# EAGLE board interfacez_r2 (EAGLE 6.4)
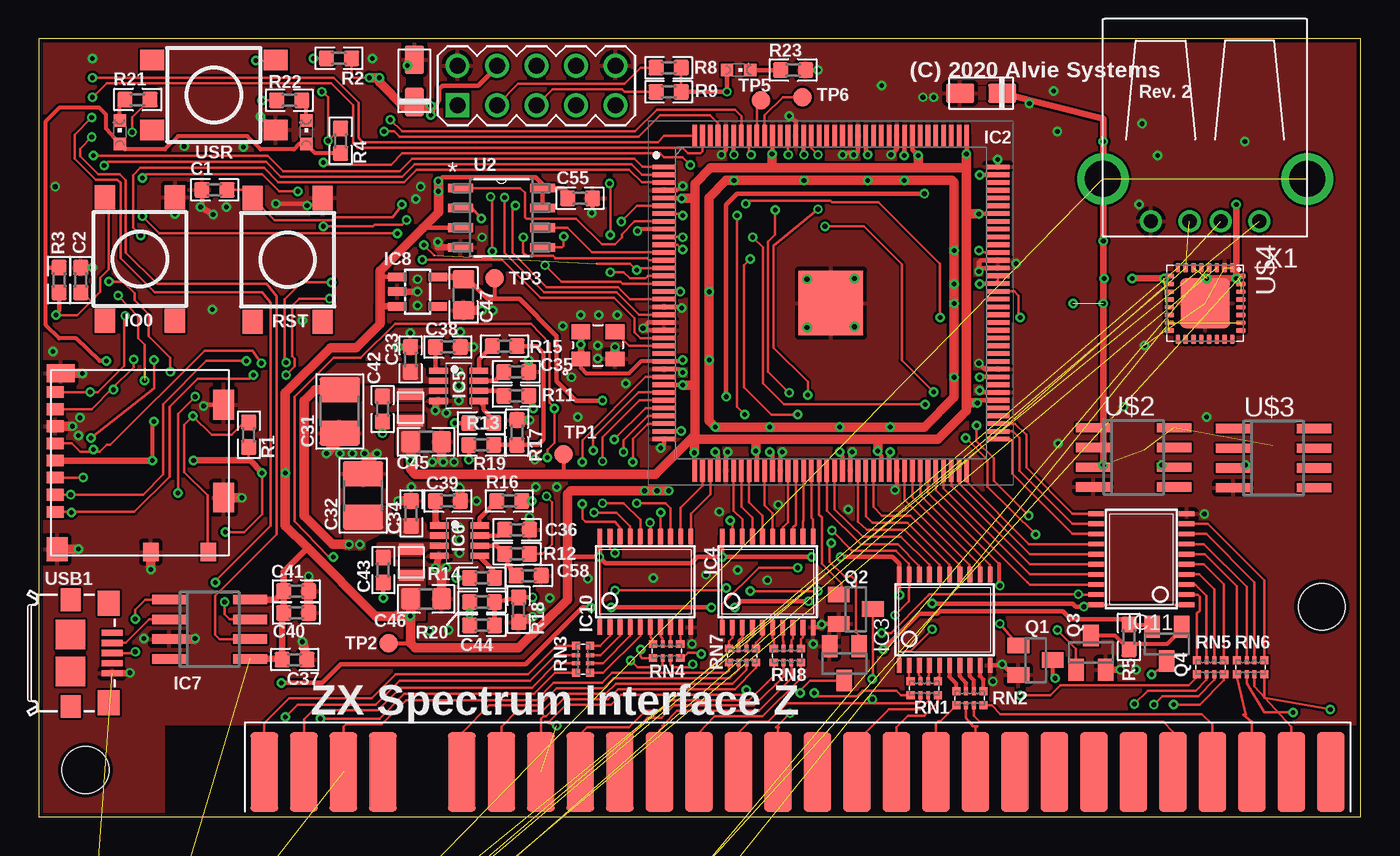
[diagram p3: board, top side]
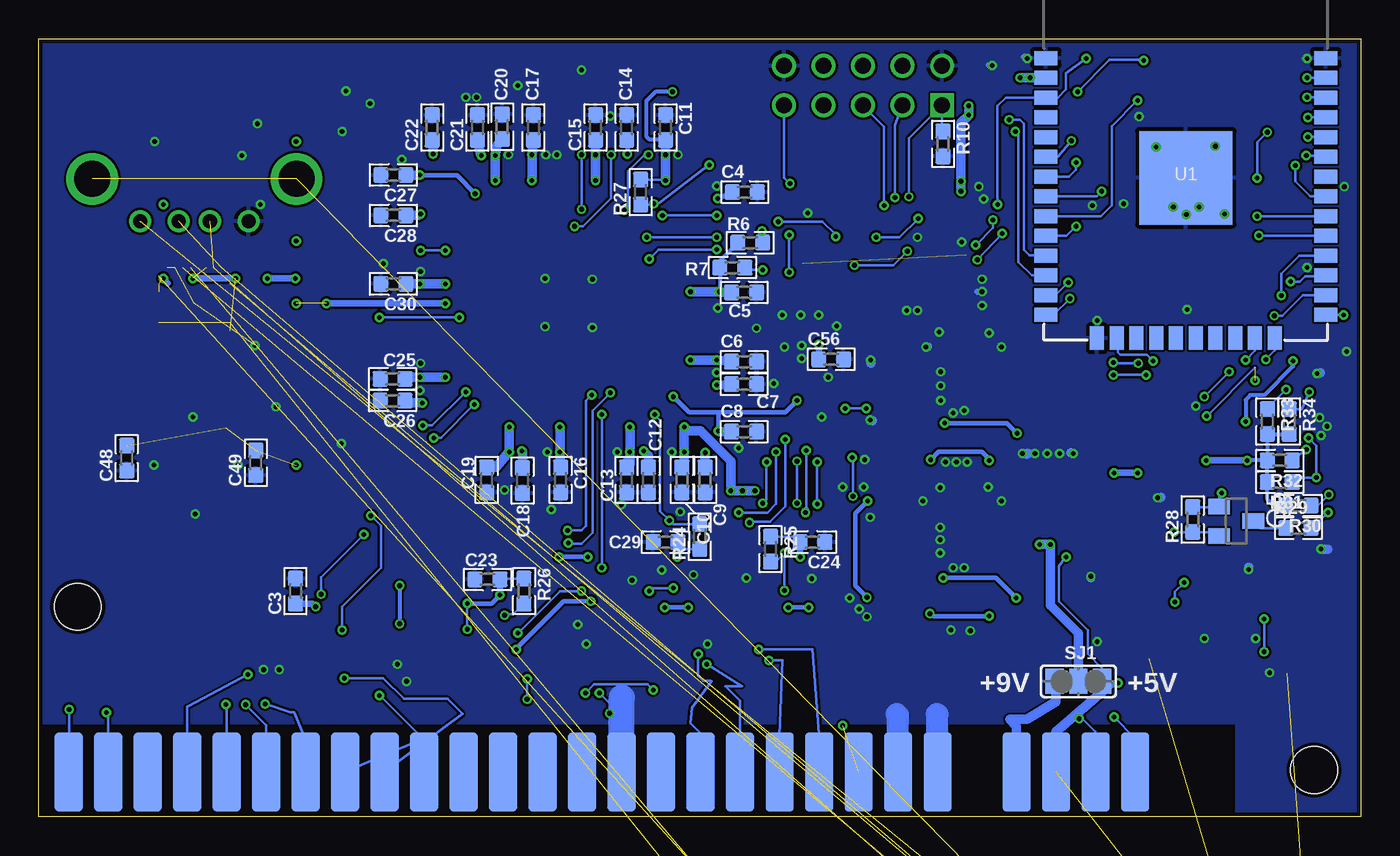
[diagram p4: board, bottom side, seen from below]

Size 85 x 50 mm. Coordinates in mm from the lower left corner, seen from the top.
Outline: 0,50 0,0 85,0 85,50 0,50
Copper layers (1*16): Top 0.035mm / dielectric 1.5mm / Bottom 0.035mm
Design rules "JLCPCB-Single-DualLayer": minimum track width 5mil, minimum drill 0.3mm, track to track 6mil, track to pad 6mil, pad to pad 6mil, via to via 6mil, smd to smd 0mil, copper to edge 10mil, drill to drill 10mil, minimum pad ring 10mil, minimum via ring 6mil, stop-mask expansion 2mil, vias tented up to drill 100mil, thermal gap 10mil
Holes 3 mm at 3,3 82.5,13.5

## Footprints (pad centres in the part's own frame; a part is rotated, then mirrored left to right if it is on the bottom)
0603 = smd 1 x 1: 1 -0.8,0; 2 0.8,0
1210 = smd 1.6 x 2.6: 1 -1.4,0; 2 1.4,0
0805 = smd 1.2 x 1.4: 1 -1,0; 2 1,0
TANT_CASE_A = smd 1.8 x 1.23: MINUS 1.355,0; PLUS -1.355,0
ZX-EDGE-DAUGHTERBOARD = smd 1.778 x 5.08 bottom: A1 6.35,-1.27; A2 3.81,-1.27; A3 1.27,-1.27; A4 -1.27,-1.27; A6 -6.35,-1.27; A7 -8.89,-1.27; A8 -11.43,-1.27; A9 -13.97,-1.27; A10 -16.51,-1.27; A11 -19.05,-1.27; A12 -21.59,-1.27; A13 -24.13,-1.27; A14 -26.67,-1.27; A15 -29.21,-1.27; A16 -31.75,-1.27; A17 -34.29,-1.27; A18 -36.83,-1.27; A19 -39.37,-1.27; A20 -41.91,-1.27; A21 -44.45,-1.27; A22 -46.99,-1.27; A23 -49.53,-1.27; A24 -52.07,-1.27; A25 -54.61,-1.27; A26 -57.15,-1.27; A27 -59.69,-1.27; A28 -62.23,-1.27 | smd 1.778 x 5.08: B1 6.35,-1.27; B2 3.81,-1.27; B3 1.27,-1.27; B4 -1.27,-1.27; B6 -6.35,-1.27; B7 -8.89,-1.27; B8 -11.43,-1.27; B9 -13.97,-1.27; B10 -16.51,-1.27; B11 -19.05,-1.27; B12 -21.59,-1.27; B13 -24.13,-1.27; B14 -26.67,-1.27; B15 -29.21,-1.27; B16 -31.75,-1.27; B17 -34.29,-1.27; B18 -36.83,-1.27; B19 -39.37,-1.27; B20 -41.91,-1.27; B21 -44.45,-1.27; B22 -46.99,-1.27; B23 -49.53,-1.27; B24 -52.07,-1.27; B25 -54.61,-1.27; B26 -57.15,-1.27; B27 -59.69,-1.27; B28 -62.23,-1.27
PIN-2X5 = drill 1.016 square: 1 -5.08,-1.27 | drill 1.016: 2 -5.08,1.27; 3 -2.54,-1.27; 4 -2.54,1.27; 5 0,-1.27; 6 0,1.27; 7 2.54,-1.27; 8 2.54,1.27; 9 5.08,-1.27; 10 5.08,1.27
SOT23-5L = smd 0.55 x 1.2: 1 -0.95,-1.3; 2 0,-1.3; 3 0.95,-1.3; 4 0.95,1.3; 5 -0.95,1.3
QFP50P2200X2200X165-145N = smd 1.475 x 0.3: 1 -10.738,8.75; 2 -10.738,8.25; 3 -10.738,7.75; 4 -10.738,7.25; 5 -10.738,6.75; 6 -10.738,6.25; 7 -10.738,5.75; 8 -10.738,5.25; 9 -10.738,4.75; 10 -10.738,4.25; 11 -10.738,3.75; 12 -10.738,3.25; 13 -10.738,2.75; 14 -10.738,2.25; 15 -10.738,1.75; 16 -10.738,1.25; 17 -10.738,0.75; 18 -10.738,0.25; 19 -10.738,-0.25; 20 -10.738,-0.75; 21 -10.738,-1.25; 22 -10.738,-1.75; 23 -10.738,-2.25; 24 -10.738,-2.75; 25 -10.738,-3.25; 26 -10.738,-3.75; 27 -10.738,-4.25; 28 -10.738,-4.75; 29 -10.738,-5.25; 30 -10.738,-5.75; 31 -10.738,-6.25; 32 -10.738,-6.75; 33 -10.738,-7.25; 34 -10.738,-7.75; 35 -10.738,-8.25; 36 -10.738,-8.75; 73 10.738,-8.75; 74 10.738,-8.25; 75 10.738,-7.75; 76 10.738,-7.25; 77 10.738,-6.75; 78 10.738,-6.25; 79 10.738,-5.75; 80 10.738,-5.25; 81 10.738,-4.75; 82 10.738,-4.25; 83 10.738,-3.75; 84 10.738,-3.25; 85 10.738,-2.75; 86 10.738,-2.25; 87 10.738,-1.75; 88 10.738,-1.25; 89 10.738,-0.75; 90 10.738,-0.25; 91 10.738,0.25; 92 10.738,0.75; 93 10.738,1.25; 94 10.738,1.75; 95 10.738,2.25; 96 10.738,2.75; 97 10.738,3.25; 98 10.738,3.75; 99 10.738,4.25; 100 10.738,4.75; 101 10.738,5.25; 102 10.738,5.75; 103 10.738,6.25; 104 10.738,6.75; 105 10.738,7.25; 106 10.738,7.75; 107 10.738,8.25; 108 10.738,8.75 | smd 0.3 x 1.475: 37 -8.75,-10.738; 38 -8.25,-10.738; 39 -7.75,-10.738; 40 -7.25,-10.738; 41 -6.75,-10.738; 42 -6.25,-10.738; 43 -5.75,-10.738; 44 -5.25,-10.738; 45 -4.75,-10.738; 46 -4.25,-10.738; 47 -3.75,-10.738; 48 -3.25,-10.738; 49 -2.75,-10.738; 50 -2.25,-10.738; 51 -1.75,-10.738; 52 -1.25,-10.738; 53 -0.75,-10.738; 54 -0.25,-10.738; 55 0.25,-10.738; 56 0.75,-10.738; 57 1.25,-10.738; 58 1.75,-10.738; 59 2.25,-10.738; 60 2.75,-10.738; 61 3.25,-10.738; 62 3.75,-10.738; 63 4.25,-10.738; 64 4.75,-10.738; 65 5.25,-10.738; 66 5.75,-10.738; 67 6.25,-10.738; 68 6.75,-10.738; 69 7.25,-10.738; 70 7.75,-10.738; 71 8.25,-10.738; 72 8.75,-10.738; 109 8.75,10.738; 110 8.25,10.738; 111 7.75,10.738; 112 7.25,10.738; 113 6.75,10.738; 114 6.25,10.738; 115 5.75,10.738; 116 5.25,10.738; 117 4.75,10.738; 118 4.25,10.738; 119 3.75,10.738; 120 3.25,10.738; 121 2.75,10.738; 122 2.25,10.738; 123 1.75,10.738; 124 1.25,10.738; 125 0.75,10.738; 126 0.25,10.738; 127 -0.25,10.738; 128 -0.75,10.738; 129 -1.25,10.738; 130 -1.75,10.738; 131 -2.25,10.738; 132 -2.75,10.738; 133 -3.25,10.738; 134 -3.75,10.738; 135 -4.25,10.738; 136 -4.75,10.738; 137 -5.25,10.738; 138 -5.75,10.738; 139 -6.25,10.738; 140 -6.75,10.738; 141 -7.25,10.738; 142 -7.75,10.738; 143 -8.25,10.738; 144 -8.75,10.738 | smd 4.15 x 4.15: 145 0,0
TSSOP20 = smd 0.305 x 0.991: 1 -2.925,-2.918; 2 -2.275,-2.918; 3 -1.625,-2.918; 4 -0.975,-2.918; 5 -0.325,-2.918; 6 0.325,-2.918; 7 0.975,-2.918; 8 1.625,-2.918; 9 2.275,-2.918; 10 2.925,-2.918; 11 2.925,2.918; 12 2.275,2.918; 13 1.625,2.918; 14 0.975,2.918; 15 0.325,2.918; 16 -0.325,2.918; 17 -0.975,2.918; 18 -1.625,2.918; 19 -2.275,2.918; 20 -2.925,2.918
SOT23-8L = smd 0.4 x 1.2: 1 -0.975,-1.3; 2 -0.325,-1.3; 3 0.325,-1.3; 4 0.975,-1.3; 5 0.975,1.3; 6 0.325,1.3; 7 -0.325,1.3; 8 -0.975,1.3
SOIC8 = smd 0.6 x 2.2: 1 -1.905,-2.6; 2 -0.635,-2.6; 3 0.635,-2.6; 4 1.905,-2.6; 5 1.905,2.6; 6 0.635,2.6; 7 -0.635,2.6; 8 -1.905,2.6
IND_0806 = smd 0.7 x 1.6: P$1 -0.85,0; P$2 0.85,0
LED-603 = smd 0.8 x 0.8: A 0,-0.75; C 0,0.75
SOT23 = smd 1 x 1.4: 1 -0.95,-1.1; 2 0.95,-1.1; 3 0,1.1
EXB28V = smd 0.525 x 0.5: 1 -0.875,-0.45; 4 0.875,-0.45; 5 0.875,0.45; 8 -0.875,0.45 | smd 0.25 x 0.5: 2 -0.25,-0.45; 3 0.25,-0.45; 6 0.25,0.45; 7 -0.25,0.45
TACTILE_SWITCH_TALL = smd 1.55 x 1.3: A1 -3.975,-2.25; A2 3.975,-2.25; B1 -3.975,2.25; B2 3.975,2.25
1040310811 = smd 0.75 x 1.1: 1 3.155,-5.45; 2 2.055,-5.45; 3 0.955,-5.45; 4 -0.145,-5.45; 5 -1.245,-5.45; 6 -2.345,-5.45; 7 -3.445,-5.45; 8 -4.545,-5.45 | smd 1.2 x 1: A 5.74,4.4; B 5.74,0.7 | smd 1.9 x 1.35: MNT1 -3.73,5.375; MNT2 2.24,5.375 | smd 1.17 x 1.8: MNT3 -5.755,-5.1 | smd 1.55 x 1.35: MNT4 5.565,-5.325
SJ_2 = smd 1.168 x 1.6: 1 -1.524,0; 2 0,0; 3 1.524,0
TP12R = smd 1.2 x 1.2: TP 0,0
SP0503 = smd 1.2 x 1.4: 1 -0.85,-1.1 | smd 1 x 1.4: 2 0.95,-1.1; 3 0.95,1.1; 4 -0.95,1.1
ESP-WROOM-32 = smd 0.9 x 1.5: 1 7.7,9; 2 6.43,9; 3 5.16,9; 4 3.89,9; 5 2.62,9; 6 1.35,9; 7 0.08,9; 8 -1.19,9; 9 -2.46,9; 10 -3.73,9; 11 -5,9; 12 -6.27,9; 13 -7.54,9; 14 -8.81,9; 25 -8.81,-9; 26 -7.54,-9; 27 -6.27,-9; 28 -5,-9; 29 -3.73,-9; 30 -2.46,-9; 31 -1.19,-9; 32 0.08,-9; 33 1.35,-9; 34 2.62,-9; 35 3.89,-9; 36 5.16,-9; 37 6.43,-9; 38 7.7,-9 | smd 1.5 x 0.9: 15 -10.3,5.715; 16 -10.3,4.445; 17 -10.3,3.175; 18 -10.3,1.905; 19 -10.3,0.635; 20 -10.3,-0.635; 21 -10.3,-1.905; 22 -10.3,-3.175; 23 -10.3,-4.445; 24 -10.3,-5.715 | smd 6 x 6: GND 0,0
SOIC127P600X175-8N = smd 1.6 x 0.559: 1 -2.642,1.905; 2 -2.642,0.635; 3 -2.642,-0.635; 4 -2.642,-1.905; 5 2.642,-1.905; 6 2.642,-0.635; 7 2.642,0.635; 8 2.642,1.905
KC3225K = smd 1.2 x 0.95: 1 -1.1,-0.875; 2 1.1,-0.875; 3 1.1,0.875; 4 -1.1,0.875
QFN32 = smd 0.6 x 0.3: 1 -2.3,1.75; 2 -2.3,1.25; 3 -2.3,0.75; 4 -2.3,0.25; 5 -2.3,-0.25; 6 -2.3,-0.75; 7 -2.3,-1.25; 8 -2.3,-1.75; 17 2.3,-1.75; 18 2.3,-1.25; 19 2.3,-0.75; 20 2.3,-0.25; 21 2.3,0.25; 22 2.3,0.75; 23 2.3,1.25; 24 2.3,1.75 | smd 0.3 x 0.6: 9 -1.75,-2.3; 10 -1.25,-2.3; 11 -0.75,-2.3; 12 -0.25,-2.3; 13 0.25,-2.3; 14 0.75,-2.3; 15 1.25,-2.3; 16 1.75,-2.3; 25 1.75,2.3; 26 1.25,2.3; 27 0.75,2.3; 28 0.25,2.3; 29 -0.25,2.3; 30 -0.75,2.3; 31 -1.25,2.3; 32 -1.75,2.3 | smd 3.2 x 3.2: EXP 0,0
CONN_USB_MICRO-B = smd 1.6 x 1.4: BODY@1 -3.2,2.45; BODY@2 3.2,2.45 | smd 1.45 x 1.3: BODY@3 3.425,0; BODY@6 -3.425,0 | smd 1.9 x 1.9: BODY@4 1.2,0; BODY@5 -1.2,0 | smd 0.4 x 1.35: P1 -1.3,2.675; P2 -0.65,2.675; P3 0,2.675; P4 0.65,2.675; P5 1.3,2.675
USB-A-H = drill 0.914: D+ 2.718,-1.003; D- 2.718,1.003; GND 2.718,-3.493; VBUS 2.718,3.493 | drill 2.311: P$5 0,-6.566; P$6 0,6.566

## Placement (x,y rotation side)
C1  1nF  [0603]  11.3,40.3 0 top
C2  1nF  [0603]  2.7,34.5 270 top
C3  100nF 6.3V  [0603]  68.5,14.5 90 bottom
C4  100nF 6.3V  [0603]  39.6,40.15 0 bottom
C5  100nF 6.3V  [0603]  39.65,33.7 0 bottom
C6  100nF 6.3V  [0603]  39.65,29.25 0 bottom
C7  100nF 6.3V  [0603]  39.65,27.8 0 bottom
C8  100nF 6.3V  [0603]  39.65,24.75 0 bottom
C9  100nF 6.3V  [0603]  42.15,21.65 270 bottom
C10  100nF 6.3V  [0603]  43.65,21.65 270 bottom
C11  100nF 6.3V  [0603]  44.7,44.3 90 bottom
C12  100nF 6.3V  [0603]  45.8,21.65 270 bottom
C13  100nF 6.3V  [0603]  47.2,21.65 270 bottom
C14  100nF 6.3V  [0603]  47.2,44.3 90 bottom
C15  100nF 6.3V  [0603]  49.2,44.3 90 bottom
C16  100nF 6.3V  [0603]  51.45,21.65 270 bottom
C17  100nF 6.3V  [0603]  53.2,44.3 90 bottom
C18  100nF 6.3V  [0603]  53.9,21.6 270 bottom
C19  100nF 6.3V  [0603]  56.2,21.65 270 bottom
C20  100nF 6.3V  [0603]  55.2,44.35 90 bottom
C21  100nF 6.3V  [0603]  56.8,44.3 90 bottom
C22  100nF 6.3V  [0603]  59.7,44.3 90 bottom
C23  100nF 6.3V  [0603]  56.15,15.25 180 bottom
C24  100nF 6.3V  [0603]  35.25,17.65 0 bottom
C25  100nF 6.3V  [0603]  62.25,28.15 180 bottom
C26  100nF 6.3V  [0603]  62.25,26.75 180 bottom
C27  100nF 6.3V  [0603]  62.2,41.25 180 bottom
C28  100nF 6.3V  [0603]  62.2,38.65 180 bottom
C29  100nF 6.3V  [0603]  44.7,17.65 180 bottom
C30  100nF 6.3V  [0603]  62.2,34.25 180 bottom
C31  22uF 16V  [1210]  19.35,26.05 90 top
C32  22uF 16V  [1210]  20.85,20.65 270 top
C33  100nF 16V  [0603]  23.9,29.4 270 top
C34  100nF 16V  [0603]  23.95,19.5 270 top
C35  100nF 16V  [0603]  30.7,28.6 180 top
C36  100nF 16V  [0603]  30.75,18.45 180 top
C37  1uF  [0603]  16.45,10.1 0 top
C38  22nF 6.3V  [0603]  26.3,30.2 180 top
C39  22nF 6.3V  [0603]  26.3,20.3 180 top
C40  10uF  [0603]  16.55,13.1 0 top
C41  100nF 6.3V  [0603]  16.55,14.5 0 top
C42  100nF 6.3V  [0603]  22.1,26.2 270 top
C43  100nF 6.3V  [0603]  22.15,15.85 270 top
C44  15pF  [0603]  28.5,12.3 180 top
C45  22uF 6.3V TBD  [0805]  24.9,24.1 180 top
C46  22uF 6.3V TBD  [0805]  24.9,14 180 top
C47  10uF 6.3V TBD  [0805]  27.3,33.55 90 top
C48  100nF 6.3V  [0603]  79.35,23.05 90 bottom
C49  100nF 6.3V  [0603]  71.05,22.75 90 bottom
C50  100nF 6.3V  [0603]  -6,-40 0 top  (outside the outline)
C51  100nF 6.3V  [0603]  -6,-44 0 top  (outside the outline)
C52  100nF 6.3V  [0603]  -6,-48 0 top  (outside the outline)
C53  100nF 6.3V  [0603]  -6,-52 0 top  (outside the outline)
C54  120uF 6.3V TANT  [TANT_CASE_A]  -6,-63 0 top  (outside the outline)
C55  100nF 6.3V  [0603]  34.8,39.75 0 top
C56  100nF 6.3V  [0603]  34.05,29.4 0 bottom
C57  47uF 6.3V TANT  [TANT_CASE_A]  24.15,47.3 90 top
C58  100nF/DNP  [0603]  31.5,15.5 180 top
C59  100nF 6.3V  [0603]  -6,-67 0 top  (outside the outline)
C60  47uF 6.3V TANT  [TANT_CASE_A]  60.6,46.5 180 top
C61  4.7uF 6.3V  [0805]  -6,-71 0 top  (outside the outline)
CONN1  ZX_EDGE_DAUGHTERBOARD  [ZX-EDGE-DAUGHTERBOARD]  20.86,1.6 180 top
CONN2  PIN-2X5  [PIN-2X5]  32,47 0 top
IC1  STMPS2141STR  [SOT23-5L]  -1,-26 0 top  (outside the outline)
IC2  EP4CE6E22C8N  [QFP50P2200X2200X165-145N]  50.92,33.02 0 top
IC3  74LCX245FT  [TSSOP20]  58.25,12.65 0 top
IC4  74LCX245FT  [TSSOP20]  46.87,15.09 0 top
IC5  MP2233DJ  [SOT23-8L]  27,27.7 270 top
IC6  MP2233DJ  [SOT23-8L]  27.05,17.75 270 top
IC7  CH330N  [SOIC8]  10.98,12.05 270 top
IC8  MIC5504-2.5YM5-TR  [SOT23-5L]  24.35,33.75 270 top
IC10  74LCX245FT  [TSSOP20]  39,15.1 0 top
IC11  74LCX245FT  [TSSOP20]  70.9,16.55 90 top
L1  VLS201610HBXR68-M1  [IND_0806]  23.9,26.3 270 top
L2  VLS201610HBX1R5-M1  [IND_0806]  23.95,16.35 270 top
LED1  LG L29K-G2J1-24  [LED-603]  5.2,44 0 top
LED2  LG L29K-G2J1-24  [LED-603]  17.2,44 0 top
LED3  LG L29K-G2J1-24  [LED-603]  45,48 270 top
Q1  BSS123  [SOT23]  64.09,10.06 270 top
Q2  BSS123  [SOT23]  52.54,13.34 270 top
Q3  BSS123  [SOT23]  67.65,10.55 0 top
Q4  BSS84  [SOT23]  72.53,11.11 180 top
Q5  BSS84  [SOT23]  8,19 270 bottom
Q6  BSS123  [SOT23]  51.8,9.85 180 top
Q7  BSS123  [SOT23]  -6,-33 0 top  (outside the outline)
R1  10K  [0603]  13.5,24.55 90 top
R2  10K  [0603]  19.3,48.75 0 top
R3  10K  [0603]  1.3,34.5 90 top
R4  10K  [0603]  19.4,43.45 270 top
R5  10K  [0603]  70.1,11.55 270 top
R6  10K  [0603]  39.25,36.9 180 bottom
R7  10K  [0603]  40.4,35.3 180 bottom
R8  10K  [0603]  40.5,48.15 0 top
R9  10K  [0603]  40.5,46.6 0 top
R10  10K  [0603]  26.85,43.25 270 bottom
R11  140K  [0603]  30.7,27.05 0 top
R12  140K  [0603]  30.75,16.9 0 top
R13  20R  [0603]  28.45,25.3 0 top
R14  20R  [0603]  28.5,15.35 0 top
R15  140K  [0603]  29.95,30.25 0 top
R16  24K  [0603]  30.25,20.3 0 top
R17  61K9  [0603]  30.75,24.7 270 top
R18  13K  [0603]  30.85,13.3 90 top
R19  30K1  [0603]  28.45,23.9 180 top
R20  40K2  [0603]  28.5,13.8 180 top
R21  2K2  [0603]  6.35,46.1 0 top
R22  2K2  [0603]  16.1,46.05 180 top
R23  2K2  [0603]  48.5,48 0 top
R24  100K  [0603]  42.5,18 90 bottom
R25  100K  [0603]  37.95,17.2 270 bottom
R26  100K  [0603]  53.8,14.5 270 bottom
R27  10K  [0603]  46.3,40.15 90 bottom
R28  10K  [0603]  10.8,19.1 90 bottom
R29  10K  [0603]  4,18.55 0 bottom
R30  10K  [0603]  4,20 180 bottom
R31  10K  [0603]  5.2,21.5 180 bottom
R32  10K  [0603]  5.2,22.9 180 bottom
R33  10K  [0603]  6,25.4 270 bottom
R34  10K  [0603]  4.6,25.4 270 bottom
R37  100K  [0603]  -1,-32 0 top  (outside the outline)
R38  100K  [0603]  -1,-36 0 top  (outside the outline)
R39  12K  [0603]  -6,-56 0 top  (outside the outline)
R40  820R  [0603]  -6,-60 0 top  (outside the outline)
RN1  33R  [EXB28V]  56.94,8.26 0 top
RN2  33R  [EXB28V]  59.87,7.61 0 top
RN3  33R  [EXB28V]  34.99,10.12 270 top
RN4  33R  [EXB28V]  40.37,10.65 0 top
RN5  33R  [EXB28V]  75.34,9.6 0 top
RN6  33R  [EXB28V]  77.92,9.6 0 top
RN7  33R  [EXB28V]  45.24,10.36 0 top
RN8  33R  [EXB28V]  48.13,10.36 0 top
S1  SWITCHES_SMD-4  [TACTILE_SWITCH_TALL]  16,35.8 90 top
S2  SWITCHES_SMD-4  [TACTILE_SWITCH_TALL]  6.5,35.85 90 top
S3  SWITCHES_SMD-4  [TACTILE_SWITCH_TALL]  11.25,46.4 0 top
SD1  1040310811  [1040310811]  6.5,22.75 270 top
SJ1  [SJ_2]  18.15,8.7 180 bottom
TP1  TPTP12R  [TP12R]  33.75,23.3 0 top
TP2  TPTP12R  [TP12R]  22.5,11.15 0 top
TP3  TPTP12R  [TP12R]  29.3,34.6 0 top
TP5  TPTP12R  [TP12R]  46.45,46.05 0 top
TP6  TPTP12R  [TP12R]  49.1,46.25 0 top
TV26  SP0503BAHT  [SP0503]  3,-25 0 top  (outside the outline)
U1  ESP-WROOM-32  [ESP-WROOM-32]  11.24,41.06 90 bottom
U2  EPCS16  [SOIC127P600X175-8N]  29.75,38.5 0 top
U$1  KC3225K-32MHz  [KC3225K]  35.95,30.3 0 top
U$2  LY68L6400SLIT  [SOIC8]  70.4,23.1 270 top
U$3  LY68L6400SLIT  [SOIC8]  79.4,23.05 270 top
U$4  USB3300-EZK  [QFN32]  75,33 270 top
USB1  CON-USB-F-MICRO-B  [CONN_USB_MICRO-B]  2.04,10.52 270 top
X1  USB-A-H  [USB-A-H]  75,41 270 top

## Tracks (layer width: path | path; a pad name or v marks a point on that pad's centre or on a via)
+1V2  (via drill 0.3)
  Top 0.254: TP1.TP 33.75,22
  Top 0.305: R19.2 v27.65,22.95 | v23.9,22.9 C45.2 | IC2.61 54.17,23.18 v53.95,23.5 | IC2.45 46.17,23.43 v46.1,23.5 | IC2.37 42.17,23.43 v42.15,23.4 | 42.25,24.25 42.17,24.12 42.2,24.55 | 53.95,24.1 53.9,24.25 | IC2.78 60.52,26.77 v60.35,26.6 | IC2.102 60.47,38.77 v60.45,38.75 | 59.73,38.77 59.65,38.8 | 59.75,26.6 59.65,26.55 | IC2.29 41.27,27.77 v41.4,27.75 | IC2.5 41.23,39.77 v41.35,39.75 | IC2.134 47.17,42.73 v47.15,42.6 | 47.15,41.95 47.05,41.7 | IC2.116 56.17,42.88 v56.55,42.5 | IC2.109 59.67,42.62 v59.65,42.6
  Top 0.61: 42.25,24.25 46.1,24.25 | 46.1,24.25 53.9,24.25 57.8,24.25 59.65,26.1 59.65,26.55 59.65,38.8 59.65,41.7 | v46.1,23.5 46.1,24.25 | v53.95,23.5 53.95,24.1 | 60.47,38.77 59.73,38.77 | v60.35,26.6 59.75,26.6 | 42.2,27.75 42.2,24.55 39.65,22 33.75,22 33.25,22 24.2,22 23.9,22.35 C45.2 | 42.2,27.75 42.2,39.75 | v41.4,27.75 42.2,27.75 | 42.2,39.75 42.2,40.7 43.2,41.7 47.05,41.7 56.55,41.7 | 42.2,39.75 v41.35,39.75 | 56.55,41.7 59.65,41.7 | v47.15,42.6 47.15,41.95 | v56.55,42.5 56.55,41.7 | v59.65,42.6 59.65,41.7 | 42.17,23.43 42.17,24.12
  Bottom 0.305: v27.65,22.95 27.15,23.45 24.35,23.45 23.85,22.95 v23.9,22.9 | v53.95,23.5 54.05,23.45 | v46.1,23.5 45.95,23.5 | v42.15,23.4 42.3,23.45 | v60.35,26.6 60.35,26.7 | v41.4,27.75 41.25,27.75 | C4.1 41.2,39.8 v41.35,39.75 | v47.15,42.6 47.15,43.45 C14.1 | 59.65,43.45 C22.1
  Bottom 0.61: v59.65,42.6 59.65,43.45 | C12.1 45.8,23.2 v46.1,23.5 | C18.1 53.9,23.5 v53.95,23.5 | C9.1 v42.15,23.4 | C7.1 v41.4,27.75 | C26.1 61.25,26.75 61.1,26.6 v60.35,26.6 | C28.1 60.55,38.65 v60.45,38.75 | C21.1 56.65,42.85 v56.55,42.5
  pour Top (no thermals): 24.7,25.8 24.7,23.3 23.1,23.3 23.1,25.8
+2V5  (via drill 0.3)
  Top 0.254: TP3.TP 29.3,33.3
  Top 0.305: IC2.107 60.52,41.27 v60.5,41.25 | v56.95,40.05 44.9,40.05 44.2,39.35 v44.2,27 | IC2.35 41.33,24.77 v41.3,24.8 | v36.25,26.75 34.55,26.75 33.3,28 33.3,30.9 30.9,33.3 29.3,33.3 28.85,33.3 27.6,34.55 C47.2
  Top 0.406: IC8.5 27.35,34.7 C47.2
  Bottom 0.305: v60.5,41.25 58.1,41.25 v56.95,40.05 | 41.3,26 37,26 v36.25,26.75 | v41.3,24.8 41.3,26 | v44.2,27 43.2,26 41.3,26
  Bottom 0.61: C27.1 v60.5,41.25 | C8.1 41.25,24.75 v41.3,24.8
+3V3  (via drill 0.3)  (13 unrouted)
  Top 0.152: IC2.97 60.53,36.27 v60.45,36.4 | IC2.94 61.66,34.51 C30.1 v60.5,34.25 | R1.1 13.5,23 13.6,22.9 | R9.2 R8.2 | R2.2 20.1,47.63 U1.2 v21.89,47.49 v21.9,47.5 | IC11.1 IC11.20 | IC3.1 55.33,10.28 55.7,10.65 56.05,10.65 v57.45,12.05 | IC10.1 36.08,16.68 v36.05,16.7 | v12,18.3 13.2,18.3 14.35,19.45 v14.35,22.1
  Top 0.254: 34.02,18.02 34,18 | IC2.26 38.72,29.27 37.95,28.5 35.2,28.5 34.85,28.85 U$1.1 | v7.4,25.4 7.3,25.2 v7.3,22.9 | v4.35,29.3 3.9,29.3 2.4,30.75 1.3,30.75 0.45,31.6 0.45,35.2 0.45,44.7 1.35,45.6 3.85,45.6 4.3,45.15 4.3,44.25 LED1.A 5.55,42.9 8.1,42.9 8.95,43.75 13.4,43.75 14.25,42.9 16.4,42.9 16.75,43.25 LED2.A 17.75,42.65 R4.2 | TP2.TP 23.9,11.15
  Top 0.305: R20.2 v27.7,13.05 C44.2 | IC2.40 43.67,23.27 v43.5,23.45 | IC2.47 47.17,23.38 v47,23.45 | IC2.56 51.67,23.18 v51.5,23.45 | IC2.62 54.67,23.52 v54.75,23.45 | IC2.81 60.42,28.27 v60.5,28.25 | IC2.93 60.52,34.27 v60.5,34.25 | IC2.26 41.38,29.27 v41.4,29.35 | IC2.17 41.23,33.77 v41.25,33.75 | IC2.139 44.67,42.73 v44.7,42.55 | IC2.130 49.17,42.62 v49.2,42.55 | IC2.122 53.17,42.67 v53.3,42.55 | IC2.117 55.67,42.58 v55.65,42.5 | v51.55,16.7 54.9,16.7 55.33,16.27 IC3.20 55.3,15.6 55.3,14.24 v55.35,14.25 | v49.7,16.7 v43.95,16.7 | IC4.20 43.94,16.96 v43.95,16.7 | 36.08,17.02 v36.05,16.7 | v36.05,16.7 36.45,16.3 41.95,16.3 42.35,16.7 v43.95,16.7 | 34.02,18.02 34.02,16.78 34.1,16.7 v36.05,16.7 | v57.45,13.7 66.5,13.7 66.7,13.5 v67.2,13.5 67.33,13.62 IC11.20 | IC8.1 21.95,34.7 | U2.7 U2.8 | U2.8 32.34,40.41 U2.8 32.4,40.65 31.95,41.1 25.95,41.1 v25.7,40.85 | CONN2.4 29.46,48.21 28.25,47 25.95,47 25.75,46.8 25.75,46.05 v25.2,45.1 | R9.2 v44.25,46.6 LED3.A | R3.2 0.55,35.3 0.45,35.2 | U2.3 24.71,37.87 24.68,37.83 | C55.1 34,40.15 33.75,40.4 U2.8 | IC10.20 36.08,16.73 v36.05,16.7 | C57.PLUS 23.84,45.95 23.5,45.6
  Top 0.406: 68.45,34.6 v68.45,33 v68.45,22.6 | 68.45,34.6 v68.45,37 v68.45,41.8 v68.45,43.4 68.45,44.85 C60.PLUS | v77,34.6 77.1,34.6 77,34.7 | v77,34.6 v75.1,34.6 | v72.35,34.6 v70.3,34.6 | v68.5,34.6 68.45,34.6 | 77,39.4 v77,39.35 77,34.7 | 77,34.7 v77,34.6 | SD1.4 v7.29,22.89 v7.3,22.9 | v9.95,22.9 13.6,22.9 v14.35,22.1 | IC7.8 15.21,13.96 C41.1 | C41.1 C40.1 15.65,13 C37.1 15.61,10.14 IC7.5 | C41.1 15.75,15.75 17.27,17.27 | IC8.3 22.1,32.8 21.95,32.95 | U$1.4 v34.85,30.35 U$1.1
  Top 0.61: v23.9,12.9 23.9,11.15 24.2,10.85 30.85,10.85 34,13.95 34,18 34,20.75 34.2,20.95 v38.95,20.95 | v23.9,12.9 C46.2 | v39.75,20.95 v38.95,20.95 | v38.95,20.95 v40.5,20.95 | v23.9,12.9 21.65,12.9 17.27,17.27 15.85,18.7 v15.85,22.1 15.85,27.25 18.75,30.15 20.4,30.15 21.95,31.7 21.95,32.95 21.95,34.7 21.95,35.1 24.68,37.83 25.7,38.85 v25.7,40.85 | v25.2,45.1 v25.2,45.7 25.1,45.6 23.5,45.6 21.9,47.2 v21.9,47.5 v21.25,47.5 | v43.5,25.05 v47,25.05 v51.5,25.05 v54.75,25.05 56.95,25.05 58.85,26.95 v58.85,28.25 v58.85,33 v58.85,34.25 v58.85,36.4 58.85,40.8 58.7,40.9 v55.65,40.9 v53.3,40.9 v49.2,40.9 v44.7,40.9 44.2,40.9 43.1,39.8 v43.1,33.75 v43.1,29.35 43.1,25.45 v43.5,25.05
  Bottom 0.152: v60.45,36.4 v58.85,36.4 | 41.2,33.8 v41.25,33.75 | R24.1 43.45,17.2 C29.1 | R25.1 36.4,18 C24.1 | R26.1 55.3,15.3 C23.1 | v57.45,12.05 v57.45,13.7 | R27.2 44.75,40.95 v44.7,40.9 | v12,18.3 R28.1 9.35,18.3 Q5.2
  Bottom 0.254: 41.2,33.8 R7.2 41.2,35.75 R6.2 | v4.35,29.3 4.35,28.95 6.2,27.1 7.1,27.1 7.4,26.8 v7.4,25.4 | v44.25,46.6 45.35,46.6 45.95,46 45.95,43.75 45.75,43.55 44.75,43.55 C11.1 | R30.2 5.6,20 6,20.4 R31.2 R32.2 | R32.2 v7.3,22.9 | R32.2 R33.2 R34.2
  Bottom 0.305: v23.9,12.9 27.55,12.9 v27.7,13.05 | v47,23.45 47,23.75 | v41.4,29.35 41.4,29.3 | v51.55,16.7 v49.7,16.7 | v57.45,13.7 55.9,13.7 v55.35,14.25
  Bottom 0.406: v66.5,33 v58.85,33 | v75.1,34.6 v72.35,34.6 | v70.3,34.6 v68.5,34.6 | 76.7,34.3 v77,34.6 | 68.5,41.75 v68.45,41.8 | C23.1 v55.35,14.25 | C29.1 43.9,16.75 v43.95,16.7 | C24.1 v36.05,16.7 | v7.3,22.9 v9.95,22.9 | v14.35,22.1 v15.85,22.1 | C3.1 67.4,13.7 v67.2,13.5 | v21.89,47.49 v21.9,47.5 | C56.1 v34.85,30.35
  Bottom 0.61: v51.5,25.05 v51.5,23.45 C16.1 | v54.75,25.05 v54.75,23.45 55.6,22.45 C19.1 | v47,25.05 v47,23.45 47,22.65 C13.1 47.2,22.8 47.1,22.9 | v58.85,28.25 v60.5,28.25 61.05,28.25 61.15,28.15 C25.1 | v58.85,34.25 v60.5,34.25 C30.1 | v43.1,29.35 v41.4,29.35 41.2,29.35 C6.1 | v43.1,33.75 v41.25,33.75 41.2,33.7 C5.1 | v44.7,40.9 v44.7,42.55 C11.1 | v49.2,40.9 v49.2,42.55 C15.1 | v53.3,40.9 v53.3,42.55 C17.1 | v55.65,40.9 v55.65,42.5 55.55,43.15 C20.1 | v40.5,20.95 40.5,22.85 42.45,24.8 43.25,24.8 v43.5,25.05 v43.5,23.45 43.5,22.8 43.65,22.65 C10.1 | v39.75,20.95 v40.5,20.95 | v38.95,20.95 v40.5,20.95 | U1.2 v21.89,47.49 | v25.2,45.7 v25.2,45.1 25.7,44.6 v25.7,40.85 v25.7,40.2
  pour Top (no thermals): 24.75,15.85 24.75,12.7 22.8,12.7 22.75,12.75 22.75,12.95 23.15,13.35 23.15,15.85
+5V  (via drill 0.3)  (2 unrouted)
  Top 0.152: v18.95,16.7 18.65,16.7 18.6,16.75 16.45,19 16.45,27 18.95,29.5 20.7,29.5 22.9,31.7 31.65,31.7 32.85,30.45 32.85,26.6 v33.15,26.25 33.15,24.05 32.7,23.6 v32.7,23.1 | R12.2 32.4,16.9 33,17.5 33,20.2 v32.65,20.6
  Top 0.254: R11.2 31.5,26.8 v31.8,26.25 | R5.1 71.44,12.35 Q4.2
  Top 0.305: R5.1 69.65,12.7 66.35,12.7 65.85,13.2 57.9,13.2 57.75,13.05 56.6,13.05 v54.3,10.75 | v49.5,13.85 45.15,13.85 v44.75,13.45 | v43.25,13.45 v36.8,13.45 | v35.5,13.45 34.95,13.45 31.3,9.8 19.4,9.8 18.2,8.6 v15.6,8.6
  Bottom 0.152: SJ1.1 16.63,9.53 17.55,10.48 17.55,12 19.4,13.85 19.4,16.1 v18.95,16.7 | v33.15,26.25 v31.8,26.25 | v32.7,23.1 32.65,23.1 v32.65,20.6
  Bottom 0.305: v54.3,10.75 54.3,10.8 51.25,13.85 v49.5,13.85 | v44.75,13.45 v43.25,13.45 | v36.8,13.45 v35.5,13.45 | v15.6,8.6 16.4,8.2 16.36,8.24
  Bottom 0.6: SJ1.1 16.63,8.51 16.36,8.24 19.59,5.46
  Bottom 0.61: CONN1.A3 19.59,5.46
+9V
  Bottom 0.6: 19.6,8.65 19.65,8.68 SJ1.3
  Bottom 0.61: CONN1.A4 22.12,5.83 22.55,6.25 21.45,6.25 19.6,7.4 19.6,8.65 | SJ1.3
A0  (via drill 0.3)
  Top 0.152: RN4.1 38.8,10.2 38.7,10.3 v38.7,10.75
  Bottom 0.152: v38.7,10.75 35.25,10.75 34.83,5.33 CONN1.A9
A1  (via drill 0.3)
  Top 0.152: RN4.2 40.12,9.77 39.9,9.6 38.5,9.6 v38.05,10.05
  Bottom 0.152: CONN1.A10 37.37,5.25 37.16,10.05 v38.05,10.05
A2  (via drill 0.3)
  Top 0.152: RN4.3 40.62,9.82 40.63,9.77 40.8,9.6 41.85,9.6 v42.05,9.8
  Bottom 0.152: CONN1.A11 39.91,5.35 39.9,6.36 39.9,7.45 40.85,8.4 39.8,8.4 v42.05,9.8
A3  (via drill 0.3)
  Top 0.152: v42.59,10.45 v42.6,10.45 42.5,10.55 41.75,10.55 41.4,10.2 RN4.4
  Bottom 0.152: CONN1.A12 42.45,5.35 43.09,6 43,7 41.75,8.7 41.8,8.75 42.3,8.75 42.6,9.05 v42.6,10.45
A4  (via drill 0.3)
  Top 0.152: RN5.4 76.22,8.77 74.66,7.21 v72.97,7.21
  Bottom 0.152: 72.92,5.17 72.92,7.17 v72.97,7.21
  Bottom 0.254: CONN1.A24 72.92,5.17
A5  (via drill 0.3)
  Top 0.152: RN5.3 75.59,8.79 74.55,7.75 72.25,7.75 v71.7,7.2
  Bottom 0.152: CONN1.A23 70.39,5.88 v71.7,7.2
A6  (via drill 0.3)
  Top 0.152: RN5.2 75.09,8.79 74.4,8.1 71.3,8.1 v70.45,7.25
  Bottom 0.152: CONN1.A22 67.84,4.95 68.6,6.7 68.85,6.7 v70.45,7.25
A7  (via drill 0.3)
  Top 0.152: v63.1,7.8 65.05,7.8 65.7,8.45 73.95,8.45 74.47,8.96 RN5.1
  Bottom 0.152: CONN1.A21 60.3,5 v63.1,7.8
A8
  Top 0.152: CONN1.B26 78,6.11 77.46,6.55 77.6,6.55 77.05,8.99 RN6.1
A9  (via drill 0.3)
  Top 0.152: RN6.2 77.67,8.57 78.8,6.7 v80.65,6.7
  Bottom 0.152: CONN1.A27 80.55,6.54 v80.65,6.7
A10
  Top 0.152: CONN1.B27 80.55,5.78 78.17,8.4 RN6.3
A11  (via drill 0.3)
  Top 0.152: RN6.4 78.8,7.64 v83.05,6.9
  Bottom 0.152: v83.05,6.9 83.05,5.84 CONN1.A28
A12  (via drill 0.3)
  Top 0.152: v18.1,6.3 21.9,6.3 23.5,7.9 31.85,7.9 33.2,9.24 RN3.4
  Bottom 0.152: CONN1.A2 17.05,5.45 17.9,6.3 v18.1,6.3
A13
  Top 0.152: CONN1.B2 17.05,6.25 17.64,6.84 21.8,6.84 23.25,8.3 31.7,8.3 33.27,9.87 RN3.3
A14  (via drill 0.3)
  Top 0.152: RN3.2 33.22,10.37 31.6,8.75 23.2,8.75 21.65,7.2 16.65,7.2 v15.85,6.4
  Bottom 0.152: 14.51,5.05 v15.85,6.4
  Bottom 0.254: CONN1.A1 14.51,5.05
A15
  Top 0.152: RN3.1 33.3,10.99 31.45,9.15 22.95,9.15 21.4,7.6 16.1,7.6 14.5,6 14.5,4.88 CONN1.B1
A_BUS_OE  (via drill 0.3)
  Top 0.152: 67.03,14.28 v66.85,14.3 | v64.1,18.15 61,21.2 61,22.95 v59.6,24.35 | v57,26.5 47.9,26.5 46.55,27.85 46.55,36.6 v45.9,37.25 | 41.25,37.25 v41.4,37.25 41.38,37.27 IC2.10 | 57.2,14.25 56.97,14.02 | 56.97,14.02 54.8,11.8 v54.2,11.8 | v37.05,14.55 44.05,14.55 v44.2,14.7 | v45.75,14.5 v50.1,14.5 | IC10.19 36.73,17.23 v37.05,16.95 | v66.85,14.3 57.26,14.3 56.97,14.02 | IC11.19 66.88,14.28 v66.85,14.3
  Bottom 0.152: v66.85,14.3 66.85,15.4 v64.1,18.15 | v59.6,24.35 59.15,24.35 v57,26.5 | v45.9,37.25 v41.4,37.25 | v44.2,14.7 45.55,14.7 v45.75,14.5 | v50.1,14.5 51.5,14.5 v54.2,11.8 | v37.05,14.55 v37.05,16.95 37.6,16.4 R25.2
ASDO  (via drill 0.3)
  Top 0.152: U2.5 33.65,36.59 33.75,36.7 v33.75,37.3 | IC2.6 38.47,39.27 v37.45,38.25
  Bottom 0.152: v33.75,37.3 33.75,37.4 34.6,38.25 v37.45,38.25
CK  (via drill 0.3)  (1 unrouted)
  Top 0.152: v33.3,5.85 32.55,6.1 32.8,6.1 33.9,7.2 36.8,7.2 37.45,7.85 45.2,7.85 v45.5,8.15 | RN1.1 55.45,7.8 55.15,8.1 52.95,8.1 52.6,7.75 50.05,7.75 v49.85,7.95
  Bottom 0.152: v45.5,8.15 45.85,8.5 49.3,8.5 v49.85,7.95
CONF_DONE  (via drill 0.3)
  Top 0.152: IC2.92 62.73,33.77 63,33.5 63,32.2 v63.1,32.1 | v57.95,32.1 57.95,35.55 54,39.5 51,39.5 50.9,39.6 45.6,39.6 v45.45,39.4 | v18.3,42.05 18.35,41.9 22.65,41.9 23.35,42.65 39.95,42.65 40.2,42.4 41.4,42.4 v41.9,41.9
  Bottom 0.152: v63.1,32.1 v57.95,32.1 | v41.9,41.9 45.1,39.45 v45.45,39.4 45.5,39.35 R27.1 | v18.3,42.05 18.3,41.6 18.75,41.15 U1.7
CTRL_OE  (via drill 0.3)
  Top 0.152: v51,18.4 52.3,17.1 55.1,17.1 55.95,16.25 IC3.19 55.95,13.86 v55.05,12.95 | v49.45,27.1 49.45,27.95 47.25,30.15 47.25,36.7 v50.1,39.05 | IC2.129 49.67,42.98 v50.1,42.55
  Bottom 0.152: v51,18.4 50.1,18.4 49.8,18.7 49.8,26.75 v49.45,27.1 | v50.1,42.55 v50.1,39.05 | v55.05,12.95 55,13 54.5,13 R26.2
D0
  Top 0.152: CONN1.B6 27.2,5.41 28.95,7.15 32.2,7.15 33.3,8.25 36.3,8.25 36.95,8.9 44.4,8.9 44.99,9.45 RN7.2
D1
  Top 0.152: CONN1.B7 29.75,5.79 30.75,6.8 32.4,6.8 33.5,7.9 36.45,7.9 37.1,8.55 44.6,8.55 45.49,9.45 RN7.3
D2
  Top 0.152: CONN1.B8 32.28,6.29 32.45,6.45 32.6,6.45 33.7,7.55 36.6,7.55 37.25,8.2 44.75,8.2 46.12,9.57 RN7.4
D3
  Top 0.152: CONN1.B11 39.91,5.55 40.2,5.85 40.1,5.85 41.05,6.8 46.3,6.8 48.38,8.88 RN8.3
D4
  Top 0.152: CONN1.B12 42.45,5.39 43.45,6.45 46.55,6.45 49.01,8.91 RN8.4
D5
  Top 0.152: 37.37,4.57 39.15,6.35 40.05,6.35 40.85,7.15 46,7.15 47.4,8.5 47.88,8.98 RN8.2
  Top 0.254: CONN1.B10 37.37,4.57
D6
  Top 0.152: RN8.1 47.26,9.06 46.85,8.65 45.65,7.5 40.65,7.5 39.95,6.8 39,6.8 37.95,5.75 35.25,5.75 34.5,5 34.5,4.2 CONN1.B9
D7
  Top 0.152: CONN1.B3 19.59,5.79 19.75,5.95 22.05,5.95 23.6,7.5 32,7.5 33.1,8.6 36.2,8.6 36.85,9.25 44.2,9.25 44.37,9.37 RN7.1
D_BUS_DIR  (via drill 0.3)
  Top 0.152: IC4.1 43.94,13.64 46.3,16 v48.8,16 | v48.8,25.85 47.1,25.85 45.35,27.6 45.35,35.45 v45.75,35.85 | IC2.11 41.08,36.77 v41.4,36.45
  Bottom 0.152: v48.8,16 v48.8,25.85 | v41.4,36.45 45.15,36.45 v45.75,35.85
D_BUS_OE  (via drill 0.3)
  Top 0.152: IC4.19 44.59,18.91 v44.45,19.05 | 45.4,25.95 v45.4,25.85 44.9,26.35 v44.9,38.65 | IC2.7 41.28,38.77 v41.4,38.65
  Bottom 0.152: v45.4,25.85 45.05,25.5 45.05,19.65 v44.45,19.05 44.2,18.8 R24.2 | v41.4,38.65 v44.9,38.65
DATA0  (via drill 0.3)
  Top 0.152: U2.2 27.86,39.13 v28.45,38.45 | v31.15,37.25 31.15,36.25 31.35,36.05 33.05,36.05 33.18,35.92 33.2,35.9 39.1,35.9 39.23,35.77 IC2.13
  Bottom 0.152: v31.15,37.25 29.65,37.25 v28.45,38.45
DCLK
  Top 0.152: IC2.12 35.58,36.27 33.98,37.87 U2.6
ESP_EN  (via drill 0.3)
  Top 0.152: v23.35,39.35 22.75,38.55 19.1,38.55 18.9,38.35 15.18,38.35 S1.B2 13.22,40.3 C1.2 | v17.65,48.75 R2.1
  Bottom 0.152: v23.35,39.35 23.35,45.7 22.82,46.23 U1.3 19.48,46.23 18.95,46.75 18.95,47.8 v17.65,48.75
ESP_IO0  (via drill 0.3)
  Top 0.152: v1.1,32.25 2.45,32.25 3.35,33.15 | 3.35,33.15 3.95,33.75 3.95,34.65 4.5,35.2 4.5,39.73 S2.B2 | C2.2 2.8,33.7 3.35,33.15
  Top 0.305: R3.1 1.3,32.55 v1.1,32.25
  Bottom 0.152: U1.25 v1.1,32.26 v1.1,32.25
ESP_IO26  (via drill 0.3)
  Top 0.152: IC2.138 45.17,45.02 44.75,45.45 39.75,45.45 38.35,44.05 23.35,44.05 v22.6,44.8
  Bottom 0.152: v22.6,44.8 21.9,44.8 21.65,44.55 21.65,36.45 21.3,36.1 20.27,36.1 U1.11
ESP_IO27  (via drill 0.3)
  Top 0.152: IC2.141 43.67,44.58 43.15,45.1 39.95,45.1 38.55,43.7 23.2,43.7 22.85,44.05 v22.2,44.05
  Bottom 0.152: U1.12 21.14,34.8 22,35.65 22,43.95 v22.2,44.05 22.05,44
ESP_MISO  (via drill 0.3)
  Top 0.152: IC2.2 38.78,41.27 38.1,41.95 24.15,41.95 23.35,41.15 15.55,41.15 14.6,42.1 4.45,42.1 v4.2,41.85
  Bottom 0.152: v4.2,41.85 4.2,40.85 3.25,39.9 2.27,39.9 U1.31
ESP_MOSI  (via drill 0.3)
  Top 0.152: v3.45,47.5 18.95,47.5 20.55,45.9 20.55,43.65 20.8,43.35 39.8,43.35 40.21,43.76 IC2.144
  Bottom 0.152: v3.45,47.5 U1.37
ESP_NCS0  (via drill 0.3)
  Top 0.152: IC2.3 38.78,40.77 37.95,41.6 24.3,41.6 23.5,40.8 15.4,40.8 14.5,41.7 6.5,41.7 6.05,41.25 6.05,37.85 v6.55,37.35
  Bottom 0.152: v6.55,37.35 2.25,37.35 U1.29
ESP_QDH  (via drill 0.3)
  Top 0.152: IC2.1 38.83,41.77 38.3,42.3 24,42.3 23.2,41.5 15.7,41.5 14.7,42.5 v3.5,42.5
  Bottom 0.152: v3.5,42.5 2.33,42.5 U1.33
ESP_QWP  (via drill 0.3)
  Top 0.152: v3.45,46.25 4.35,47.15 18.8,47.15 20.2,45.75 20.2,43.3 20.5,43 41.4,43 41.75,42.65 42.55,42.65 42.67,42.77 IC2.143
  Bottom 0.152: v3.45,46.25 2.27,46.25 U1.36
ESP_RX  (via drill 0.3)
  Top 0.152: IC7.6 11.63,11.41 11.35,11.7 11.35,14.2 15.3,18.15 15.3,33.45 14.65,34.25 7.6,34.25 5.6,36.25 5.6,40.9 5.2,41.3 3.8,41.3 2.65,42.45 2.65,42.95 v3.4,43.7
  Bottom 0.152: v3.4,43.7 2.25,43.7 U1.34
ESP_SCK  (via drill 0.3)
  Top 0.152: v24.65,35.8 29.8,35.8 32.25,33.35 37,33.35 38.3,32.05 38.3,31.15 38.68,30.77 IC2.23 | v6.65,38.6 7.75,37.5 v23.05,37.5
  Bottom 0.152: v6.65,38.6 U1.30 | v24.65,35.8 v23.05,37.5
ESP_TX  (via drill 0.3)
  Top 0.152: IC7.7 12.27,12.69 11.95,13 v11.95,13.8 | v11.35,15.05 11.35,15.15 14.9,18.7 14.9,33.05 14.35,33.7 7.45,33.7 5.25,35.9 5.25,40.75 5.05,40.95 3.65,40.95 2.3,42.3 2.3,43.85 v3.4,44.95
  Bottom 0.152: v11.95,13.8 11.95,14.45 v11.35,15.05 | v3.4,44.95 U1.35
FORCE_INT
  Top 0.152: IC2.53 50.17,19.43 50.35,19.25 50.35,16.25 51.6,15 51.6,14.45
  Top 0.254: 51.6,14.45 Q2.1
FORCE_NMI  (via drill 0.3)
  Top 0.152: IC2.137 45.67,42.67 v45.8,42.55 | v47.35,39 47.35,37.4 46.9,36.95 46.9,28.6 v48.25,27.25 | v50.95,17.6 50.85,17.35 50.85,16.4 51.8,15.45 52.25,15.45 52.55,15.15 52.55,11.85 52.75,11.65 Q6.1
  Bottom 0.152: v45.8,42.55 46.05,42.55 47.1,41.5 47.1,39.25 v47.35,39 | v48.25,27.25 49.4,26.1 49.4,18.25 50.1,17.55 50.75,17.55 v50.95,17.6
FORCE_RESET  (via drill 0.3)
  Top 0.152: IC2.67 57.17,20.82 61.75,16.25 | v61.8,12.4 Q1.1
  Top 0.254: 61.75,16.25 61.75,14.85 v61.8,14.85
  Bottom 0.254: v61.8,14.85 v61.8,12.4
FORCE_ROMCS  (via drill 0.3)
  Top 0.152: IC2.132 48.17,42.58 v48.2,42.55 | v50.55,37.95 53.05,37.95 55.5,35.5 55.5,29.35 v57.55,27.3 | v60.3,25.15 60.3,24.15 61.4,23.05 61.4,21.6 v63.65,19.35 | Q3.1 66.7,10.8 v65.5,12
  Bottom 0.152: v48.2,42.55 48.2,39.75 50,37.95 v50.55,37.95 | v60.3,25.15 59.7,25.15 v57.55,27.3 | v65.5,12 65.5,13.5 63,16 63,18.7 v63.65,19.35
FR1
  Top 0.254: Q4.1 73.48,12.03 72.55,11.1 70.45,11.1 R5.2 69.2,11.65 Q3.3
GND  (via drill 0.3)  (13 unrouted)
  Top 0.152: v52.45,31.5 IC2.145
  Top 0.305: IC2.140 44.17,42.88 v43.9,42.55 | IC2.131 48.67,44.67 v48.25,45.05 | IC2.123 52.67,42.77 52.65,42.75 52.3,42.6 52.08,42.67 v52.4,42.55 | IC2.118 55.17,42.92 v54.8,42.55 | IC2.108 61.66,42.19 v61.65,42.25 | IC2.95 60.63,35.27 v60.45,35.05 60.45,35.65 60.57,35.77 IC2.96 | IC2.79 60.63,27.27 v60.5,27.4 | IC2.82 60.83,28.77 v60.45,29.15 | IC2.63 55.17,21.12 v55.05,21 | IC2.57 52.17,23.38 v52.3,23.45 | IC2.48 47.67,23.23 v47.8,23.45 | IC2.41 44.17,23.32 v44.3,23.45 | IC2.4 41.02,40.27 v41.4,40.55 | IC2.19 41.28,32.77 v41.35,32.7 | IC2.27 41.18,28.77 v41.4,28.55 | IC2.36 40.19,23.89 v40,23.7 | SD1.MNT1 10.68,26.48 v10.6,26.4 | IC2.21 39.22,31.77 v38.85,31.4 38.98,31.27 IC2.22 | IC3.10 61.89,9.74 v61.95,9.8 62.64,9.11 Q1.2 | Q2.2 50.39,12.39 v50.35,12.35 50.17,12.17 IC4.10 | 25.52,26.73 IC5.4 | S3.A2 15.1,44.15 v14.25,45 | S2.A2 v8.75,38.75 | S1.A2 18.18,39.77 17.75,39.35 v17.25,39.3 17.25,39.4 v15.25,39.4 | C1.1 10.5,39.3 v10.4,39.2 | C2.1 v3.45,35.3 | R23.2 v50.1,48 | C55.2 35.6,38.85 v35.55,38.8
  Top 0.406: 25.52,26.73 v25.5,26.1 | C33.1 v23.1,30.2 | 3.44,48.77 v3.45,48.75 | v11.21,38.71 v10.4,39.2 | 21.43,48.77 v21.45,48.75 | IC8.2 v24.35,33.75 | USB1.P5 5.82,9.22 v5.85,9.25 | IC6.4 v25.5,16 | U2.4 25.66,36.59 v25.65,36.95 | Q3.2 v69.55,9.45
  Top 0.61: C38.1 v27.95,30.2 | C35.1 v31.5,29.35 | R17.1 v31.55,25.5 | C47.1 v28.5,32.55 | C31.1 19.35,24.25 v18.5,23.35 | C32.1 20.85,22.6 v21.75,23.35 | C34.1 v23.1,20.3 | C39.1 27.1,21.1 v27.05,21.15 | v17.35,15.45 C41.2 C40.2 | IC7.3 10.02,11.41 v10.05,11.45 | R18.1 v31.75,12.85 | C36.1 v31.55,19.25 | C46.1 25.9,15.85 v25.5,16 | C45.1 25.9,22.9 v26,22.8 | SD1.MNT2 v13.04,20.51 v13.05,20.5 | SD1.B v7.2,15.9 | SD1.MNT4 2.54,17.18 v2.55,17.2 | C37.2 v16.95,11.25 | SD1.6 v2.15,25.09 v2.15,25.1 | SD1.MNT3 v2.79,28.5 v2.8,28.5 | U$1.2 v37.05,30.2
  Bottom 0.152: U1.GND 11.24,41.14 v13.15,43.05 | 8.8,38.85 10.05,38.85 v10.4,39.2 | v11.21,38.71 11.56,38.71 v12.05,39.2
  Bottom 0.305: v43.9,42.55 43.85,42.6 | v54.8,42.55 54.7,42.5 | v61.65,42.25 61.65,42.1 | v60.45,29.15 60.5,29.2 | v41.4,40.55 41.3,40.65 | v41.35,32.7 41.35,32.75 | v41.4,28.55 41.45,28.55 | v40,23.7 39.9,23.7 | v14.25,45 14.2,45.05 | v8.75,38.75 8.75,38.8 8.8,38.85 | v17.25,39.3 17.4,39.3 | 11.24,41.14 11.24,41.21 v9.35,43.1 | v3.45,35.3 3.3,35.3 | v50.1,48 49.95,48 | v35.55,38.8 35.55,38.9
  Bottom 0.406: v23.1,30.2 23.1,30.3 | v3.45,48.75 3.6,48.75 | U1.GND v11.21,38.71 | v21.45,48.75 21.55,48.75 21.65,48.85 | v23.7,48.3 23.9,48.3 | v24.35,33.75 24.65,33.75 | v5.85,9.25 5.95,9.25
  Bottom 0.61: v27.95,30.2 27.85,30.2 | v31.5,29.35 31.5,29.15 | v31.55,25.5 31.4,25.45 | v18.5,23.35 18.65,23.4 | v21.75,23.35 21.45,23.3 21.4,23.35 | v17.35,15.45 17.35,15.35 | v13.05,20.5 12.9,20.5 12.85,20.55 | v7.2,15.9 7.2,16.05 | v2.55,17.2 2.1,17.2 | v2.8,28.5 2.65,28.5 2.6,28.55
  Bottom 1.422: CONN1.A6 27.2,6.55 27.25,6.6 | CONN1.A7 29.75,6.5 29.85,6.6
  Bottom 1.676: CONN1.A14 47.52,7.62 47.5,7.65
  other vias: 26.2,25.95 27,28.6 27,27.7 27,26.75 23.9,31.1 27.1,31.15 23.95,21.2 25.3,22.8 26.7,22.8 77.55,43.4 77.6,22.6 42,11.1 49.8,11.1 61.35,8.7 74.95,19.45 49.4,34.55 52.45,34.6 49.4,31.45 2.55,24.5 2.65,25.65 6.75,11.45 35.95,29.45 35.95,30.3 31.95,21.2 33.3,21.2 32.25,13.35 32.85,14.05 26.35,12 25.1,11.95 31.9,22.95 34.65,25.7 37.75,27.85 34.25,28.25 29.2,32.55 28.5,37.25 35.3,15.3 39.5,15.35 42.9,15.55 44.95,15.85 46.85,15.2 16.95,31.9 24.35,34.55 24.35,32.85 19.35,23.35 20.15,23.35 20.95,23.35 27.05,17.8 27.05,18.6 27.05,16.95 28.15,20.3 26.2,16 1.05,40.5 24.55,40.5 24.25,39.7 71.95,42.5 70.75,39.35 71.1,30.3 69.75,26.35 72.2,22.6 75.1,25.7 70.55,9.45 11.15,32.6 0.9,29.9 43.75,19.6 47.55,20.05 65.55,24 62.85,35.55 56.85,46.25 57.55,46.25 54.2,47 51.7,42.55 37.2,32.25 36,32.25 34.85,32.25 33.7,31.55 70.95,44.55 63.7,45.85 52.05,19.75 65.25,46.65 65.5,44.05
  pour Bottom: 0,0 0,50 85,50 85,6 8,6 8,0
  pour Top (rank 2): 0,50 0,0 8,0 8,6 85,6 85,50
INT  (via drill 0.3)
  Top 0.152: CONN1.B13 44.98,5.38 45.7,6.1 46.9,6.1 48.1,7.3 53.6,7.3 | RN1.2 56.69,7.44 56.55,7.3 53.6,7.3 | Q2.3 53.64,8.69 v53.6,8.85 | v53.6,7.55 53.6,7.3
  Bottom 0.152: v53.6,8.85 v53.6,7.55
IORQ
  Top 0.152: CONN1.B17 55.15,5.75 55.9,6.5 56.95,6.5 57.81,7.37 RN1.4
LED1  (via drill 0.3)
  Top 0.152: v16.65,40.2 15.45,40.2 14.35,41.3 6.9,41.3 v6.65,41.05 | v6,44 6,44.95 R21.2
  Bottom 0.152: U1.8 16.98,39.88 v16.65,40.2 | v6.65,41.05 6.65,43.35 v6,44
LED2  (via drill 0.3)
  Top 0.152: v14.35,46.05 R22.2
  Bottom 0.152: U1.9 16.7,38.6 16,39.3 16,44.4 v14.35,46.05
M1
  Top 0.152: CONN1.B24 72.92,5.47 72.3,6.1 60.5,6.1 60.12,6.48 RN2.3
MREQ
  Top 0.152: CONN1.B16 52.6,4.86 54.65,6.9 56.65,6.9 57.19,7.44 RN1.3
N$1  (via drill 0.3)
  Top 0.254: IC2.9 38.62,37.77 v38.5,37.65
  Bottom 0.254: v38.5,37.65 38.5,36.95 R6.1
N$2
  Top 0.254: LED1.C 5.2,45.75 R21.1
N$3
  Top 0.254: LED2.C 17.2,45.75 R22.1
N$4
  Top 0.305: LED3.C R23.1
N$5
  Top 0.152: IC2.136 46.17,45.77 TP5.TP
N$6
  Top 0.152: IC2.135 46.67,45.08 47.85,46.25 TP6.TP
N$7
  Top 0.152: 55.95,9.51 55.95,8.82 RN1.8
  Top 0.254: IC3.2 55.95,9.51
N$8
  Top 0.152: RN1.7 56.69,9.01 56.6,9.1 56.6,9.74 IC3.3
  Top 0.254: IC3.3 56.6,9.46
N$9
  Top 0.152: IC10.2 36.73,11.62 36.09,10.99 RN3.8
N$10
  Top 0.152: IC10.3 37.38,11.62 36.12,10.37 RN3.7
N$11
  Top 0.152: IC10.4 38.02,11.62 36.27,9.87 RN3.6
N$12
  Top 0.152: IC10.5 38.67,11.62 36.3,9.24 RN3.5
N$13
  Top 0.152: IC2.24 37.95,30.27 U$1.3
  Top 0.305: U$1.3
N$14
  Top 0.152: IC10.6 39.33,11.57 39.49,11.36 RN4.8
N$15
  Top 0.152: IC10.7 39.98,11.62 40.12,11.43 RN4.7
N$16
  Top 0.152: IC4.2 44.59,11.49 44.37,11.27 RN7.8
N$17
  Top 0.152: IC4.3 45.24,11.54 44.99,11.29 RN7.7
N$18
  Top 0.152: IC10.8 40.62,11.53 40.62,11.38 RN4.6
N$19
  Top 0.305: IC6.5 28.35,16.7 29.3,15.75 R14.2
N$20  (1 unrouted)
N$21  (via drill 0.3)
  Top 0.305: R14.1 v26.85,15.35 | v22.15,14.05 C43.2
  Bottom 0.305: v26.85,15.35 23.45,15.35 v22.15,14.05
N$22
  Top 0.152: IC10.9 41.27,11.47 41.3,11.36 RN4.5
N$23
  Top 0.152: RN5.8 74.47,13.06 74.65,13.25 74.65,14.15 74.53,14.28 IC11.2
N$24
  Top 0.152: RN5.7 75.09,14.21 74.38,14.93 IC11.3
N$25
  Top 0.152: RN5.6 75.59,14.61 74.62,15.57 IC11.4
N$26
  Top 0.152: RN5.5 76.22,14.94 74.92,16.23 IC11.5
N$27
  Top 0.152: RN6.8 77.05,14.8 74.97,16.88 IC11.6
N$28
  Top 0.152: RN6.7 77.67,14.78 74.92,17.52 IC11.7
N$29
  Top 0.152: RN6.6 78.17,15.08 75.08,18.18 IC11.8
N$30
  Top 0.152: RN6.5 78.8,15.21 75.17,18.82 IC11.9
N$31
  Top 0.152: IC4.4 45.89,11.59 45.49,11.2 RN7.6
N$32
  Top 0.152: IC4.5 46.54,11.59 46.12,11.17 RN7.5
N$33
  Top 0.152: IC4.6 47.19,11.46 47.26,11.39 RN8.8
N$34
  Top 0.152: IC4.7 47.84,11.31 47.88,11.27 RN8.7
N$35
  Top 0.152: IC4.8 48.49,11.44 48.38,11.34 RN8.6
N$36
  Top 0.152: IC4.9 49.14,11.54 49.01,11.41 RN8.5
N$37
  Top 0.152: RN1.6 57.19,9.04 57.25,9.1 57.25,9.74 IC3.4
  Top 0.254: IC3.4 57.26,9.4
N$38
  Top 0.152: RN1.5 57.81,8.96 57.9,9.05 57.9,9.74 IC3.5
  Top 0.254: IC3.5 57.91,9.36 | RN1.5 57.91,8.71
N$39
  Top 0.254: IC3.6 58.55,8.99 58.95,8.6 58.99,8.54 RN2.8
N$40
  Top 0.254: IC3.7 59.2,9.04 59.62,8.58 RN2.7
N$41
  Top 0.254: IC3.8 59.85,9.04 60.12,8.78 RN2.6
N$42
  Top 0.254: IC3.9 60.51,9.04 60.74,8.8 RN2.5
N$43
  Top 0.406: C39.2 25.5,18.98 IC6.1
N$44
  Top 0.305: R13.2 29.25,25.5 28.6,26.15 28.6,26.43 IC5.5
N$45
  Top 0.305: IC6.7 29.57,18.07 C36.2
N$46  (via drill 0.3)
  Top 0.305: R13.1 v26.75,25.3 | v22.1,24.65 C42.2
  Bottom 0.305: v26.75,25.3 22.75,25.3 v22.1,24.65
N$47
  Top 0.305: C38.2 25.5,28.88 IC5.1
N$48
  Top 0.305: IC5.7 29.32,28.02 C35.2
N$49
  Top 0.305: IC6.8 28.35,19.2 R16.1
N$50  (via drill 0.3)
  Top 0.305: C44.1 R20.1 R18.2 v31.75,14.1 | v31.7,20.3 R16.2
  Bottom 0.305: v31.75,14.1 32.5,14.85 32.5,19.5 v31.7,20.3
N$51
  Top 0.305: IC5.8 28.3,29.4 R15.1
N$52
  Top 0.305: IC6.6 29.43,17.43 R12.1 30.15,16.7 30.15,16.2 30.7,15.65 C58.2
N$53
  Top 0.305: R19.1 R17.2 32.1,23.9 32.45,24.25 32.45,29.8 32,30.25 R15.2
N$54
  Top 0.305: IC5.6 29.57,27.38 R11.1
N$55  (3 unrouted)
N$56
  Bottom 0.152: R29.1 6.45,18.55 Q5.3
N$57  (1 unrouted)
N$149  (via drill 0.3)
  Top 0.152: USB1.P3 6.12,10.52 v6.2,10.6 | v6.2,12.7 6.2,13.3 6.85,13.95 IC7.1
  Bottom 0.152: v6.2,10.6 v6.2,12.7
N$150
  Top 0.152: USB1.P2 5.57,11.17 7.1,12.7 8.37,12.7 IC7.2
NCONFIG  (via drill 0.3)  (1 unrouted)
  Top 0.152: IC2.14 38.57,35.27 v38.45,35.15 38.4,35.15 38,35.55 35.9,35.55 | v18.3,37.95 21.5,37.95 21.6,38.05 23.35,38.05 v23.65,38.35 | v24.75,36.75 25.4,36.1
  Bottom 0.152: v38.45,35.15 39.45,35.15 R7.1 | U1.10 18.91,37.34 v18.3,37.95 | v23.65,38.35 23.65,37.85 v24.75,36.75
NCSO
  Top 0.152: U2.1 28.14,40.41 30.95,40.4 31.25,40.1 31.25,38.55 31.35,38.45 34.55,38.45 36.2,36.8 37.05,36.8 37.5,37.25 37.5,37.45 38.32,38.27 IC2.8
NMI  (via drill 0.3)
  Top 0.152: CONN1.B14 47.52,5.67 47.6,5.75 47.4,5.75 v48.3,6.65 | v48.95,7.95 48.95,8.1 49.6,8.75 Q6.3
  Bottom 0.152: v48.3,6.65 48.3,7.3 v48.95,7.95
PE  (2 unrouted)
PEN1  (2 unrouted)
PULLUP_EN  (via drill 0.3)
  Top 0.152: v8.95,20.8 8.95,25.9 v10.05,27 | v8.45,28.6 8.45,29.5 7.05,30.9 7.05,32.3 6.15,33.2 6.15,33.65 5.4,34.4 v4.5,34.4
  Bottom 0.152: R28.2 9.15,19.9 Q5.1 9.1,20.65 v8.95,20.8 | v10.05,27 v8.45,28.6 | v4.5,34.4 3.9,34.4 3.55,34.75 2.85,34.75 2.8,34.8 U1.27
RD
  Top 0.152: CONN1.B18 57.69,5.99 57.85,6.15 57.98,6.15 RN2.1
RESET  (via drill 0.3)
  Top 0.254: Q1.3 65.19,9.04 v65.35,8.9
  Bottom 0.152: CONN1.A20 57.77,6.62 58.72,7.57 61.52,7.57 62.85,8.9 v65.35,8.9
RFSH
  Top 0.152: RN2.4 61.29,7.16 61.85,6.6 74.8,6.6 75.47,5.93 CONN1.B25
ROMCS  (via drill 0.3)
  Top 0.152: v71.55,9.15 72.55,9.77 Q4.3
  Bottom 0.152: CONN1.A25 75.47,7.07 v71.55,9.15
SDMMC_CK  (via drill 0.3)
  Top 0.152: SD1.5 2.1,24 2.65,23.45 3.3,23.45 | 3.3,23.45 3.9,23.45 4.35,23.9 4.6,23.9 10.65,29.95 13.75,29.95 v14.3,29.15 | v3.5,23.6 3.3,23.45 | v18.8,34.35 16.9,34.35 15.8,33.25 15.8,29.3 v15.9,29.2
  Bottom 0.152: R32.1 4.4,22.95 v3.5,23.6 | U1.13 19.62,33.52 v18.8,34.35 | v15.9,29.2 15.8,29.15 v14.3,29.15
SDMMC_CMD  (via drill 0.3)
  Top 0.152: v7.4,29.35 7.4,27.55 v3.35,24.35 | v2.85,21.8 SD1.3
  Bottom 0.152: U1.23 6.79,29.95 v7.4,29.35 | v3.35,24.35 2.85,23.85 v2.85,21.8 4.1,21.8 R31.1
SDMMC_D0  (via drill 0.3)
  Top 0.152: v6.1,29.4 6.1,28.9 4.7,27.55 | 4.7,27.55 3.4,26.2 SD1.7 | v4.8,27.45 4.7,27.55
  Bottom 0.152: U1.24 5.53,29.98 v6.1,29.4 | R33.1 6,26.25 v4.8,27.45
SDMMC_D1  (via drill 0.3)
  Top 0.152: 5.5,31.85 5.55,31.9 v5.55,32.2 5.5,32.15 5.5,29 3.79,27.3 v3.3,27.3 | SD1.8 v3.3,27.3 | v3.3,27.3
  Bottom 0.152: U1.26 3.73,33.52 5.05,32.2 v5.55,32.2 | R34.1 3.8,26.2 v3.3,27.3
SDMMC_D2  (via drill 0.3)
  Top 0.152: SD1.1 2.15,19.59 | 2.15,19.59 6.14,19.59 8.4,21.85 8.4,26.35 10.2,28.15 13.55,28.15 v13.8,28.4 | v2.1,19.55 2.15,19.59 | v18.7,33.3 16.75,33.3 16.3,32.85 16.3,29.6 16.45,29.45 16.45,28.95 v15.9,28.4
  Bottom 0.152: R29.2 2.9,18.8 v2.1,19.55 | U1.14 19.75,32.26 v18.7,33.3 | v15.9,28.4 v13.8,28.4
SDMMC_D3  (via drill 0.3)
  Top 0.152: SD1.2 v2.05,20.7 | v2.05,20.7 6.7,20.7 8,22 8,26.5 10.75,29.3 v13.35,29.3 | v2.05,20.7
  Bottom 0.152: R30.1 2.75,20 v2.05,20.7 | v13.35,29.3 13.75,29.7 15.45,29.7 15.6,29.85 15.6,30.68 U1.16
SDMMC_DET  (via drill 0.3)  (1 unrouted)
  Top 0.152: SD1.A 10.85,17.06 10.85,20.65 9.35,22.15 9.35,25.2 v9.9,25.75 11.1,24.55 12.4,24.55 13.2,25.35 R1.2 | v5.1,33.5 6.4,32.15 6.4,30.75 6.8,30.35 v6.8,28.05
  Bottom 0.152: v9.9,25.75 6.79,28.86 | U1.28 3.94,36.06 5.1,34.9 v5.1,33.5 | v6.8,28.05 6.85,28.05
SW1
  pour Top (no thermals): 25.8,27.45 21.7,27.45 21.7,26.7 22.6,26.7 23,26.8 24.5,26.8 25,27.3 25.8,27.3
SW2
  pour Top (no thermals): 25.85,17.45 21.8,17.5 21.8,16.75 22.65,16.75 23.05,16.85 24.55,16.85 25.05,17.35 25.85,17.35
  pour Top (no thermals): 25.85,17.5 21.8,17.5 21.8,16.8 22.65,16.8 23.05,16.9 24.55,16.9 25.05,17.4 25.85,17.4
SWITCH  (via drill 0.3)
  Top 0.152: v18.2,46.6 18.35,46.45 18.4,46.45 18.6,46.25 v18.6,43.45 R4.1 | v13.95,48.6 15.18,48.6
  Top 0.254: 15.18,48.6 S3.B2
  Bottom 0.152: U1.6 19.48,42.41 v18.6,43.45 | v18.2,46.6 16.15,48.65 14,48.65 v13.95,48.6
TCK  (via drill 0.3)
  Top 0.152: v29.15,36.35 29.15,39.75 v29.05,39.85 | v32.55,35.45 33.6,34.4 37.4,34.4 37.53,34.27 IC2.16
  Bottom 0.152: v32.55,35.45 30.05,35.45 v29.15,36.35 | v29.05,39.85 29.05,43.6 CONN2.1 26.92,44.12 R10.1
TDI  (via drill 0.3)
  Top 0.152: IC2.15 39.17,34.77 39,34.6 38,34.6 37.6,35 v36.75,35 36.78,35.12 | v36.75,37.4 36.75,40.65 v36.7,40.7
  Bottom 0.152: CONN2.9 37.08,41.08 v36.7,40.7 | v36.75,35 v36.75,37.4
TDO  (via drill 0.3)
  Top 0.152: IC2.20 38.58,32.27 37.15,33.7 32.5,33.7 29.95,36.25 v29.95,39.8 | R8.1 38.7,48.15 37.65,47.1 30.83,47.1 CONN2.3
  Bottom 0.152: CONN2.3 29.96,44.46 v29.95,39.8
TMS  (via drill 0.3)
  Top 0.152: IC2.18 38.03,33.27 37.25,34.05 32.65,34.05 30.45,36.25 30.45,39.1 v30.65,39.3 | R9.1 37.65,46.6 37.5,46.75 33.02,46.75 CONN2.5
  Bottom 0.152: CONN2.5 32,45.7 30.65,44.35 v30.65,39.3
USB_FLT  (2 unrouted)
USB_PWREN  (1 unrouted)
USBHS_DM  (2 unrouted)
USBHS_DP  (2 unrouted)
USBHS_VBUS  (4 unrouted)
VREG  (via drill 0.3)
  Top 0.6: C31.2 17.75,27.45 17.05,26.75 17.05,19.35 18.9,17.5 v19.95,17.5
  Bottom 0.6: v20.65,17.5 v19.95,17.5 19.95,13.6 18.15,11.8 SJ1.2
  pour Top (no thermals): 18.2,28.15 19.2,29.05 24.45,29.05 24.75,28.75 24.75,28.35 25,28.1 25.7,28.1 25.7,27.95 20.75,27.95
  pour Top (no thermals): 21.9,19.9 22.5,19.9 22.55,19.65 23.1,19.1 24.5,19.1 24.8,18.8 24.8,18.4 25.05,18.15 25.75,18.15 25.75,18 23.35,18 23.1,18.25 21.9,18.25
  pour Top (no thermals): 19.7,18.95 19.7,17.25 20.9,17.25 20.9,17.75 21.8,18.2 21.8,18.95
WR
  Top 0.152: CONN1.B19 60.23,5.67 60.35,5.8 60.05,5.8 59.62,6.37 RN2.2
XCK
  Top 0.152: IC3.18 56.6,16.14 55.25,17.5 52.85,17.5 50.67,19.68 IC2.54
XD0
  Top 0.152: IC2.43 45.17,19.93 45.89,19.21 IC4.17
XD1
  Top 0.152: IC2.44 45.67,20.23 46.54,19.36 IC4.16
XD2
  Top 0.152: IC2.46 46.67,20.02 47.19,19.51 IC4.15
XD3
  Top 0.152: IC2.51 49.17,19.02 49.14,18.99 IC4.12
XD4
  Top 0.152: IC2.52 49.67,19.23 49.79,19.11 IC4.11
XD5
  Top 0.152: IC2.50 48.67,18.77 48.49,18.59 IC4.13
XD6
  Top 0.152: IC2.49 48.17,18.93 47.84,18.59 IC4.14
XD7
  Top 0.152: IC2.42 44.67,19.68 45.24,19.11 IC4.18
XINT
  Top 0.152: IC3.17 57.26,16.2 55.45,18 53,18 51.17,19.77 IC2.55
XIORQ
  Top 0.152: IC2.59 53.17,19.32 53.6,18.9 55.85,18.9 58.55,16.2 IC3.15
XM1
  Top 0.152: IC2.65 56.17,20.52 60.51,16.2 IC3.12
XMREQ
  Top 0.152: IC2.58 52.67,18.98 53.25,18.45 55.65,18.45 57.91,16.2 IC3.16
XRD
  Top 0.152: IC2.60 53.67,19.93 54.2,19.35 56.05,19.35 59.2,16.2 IC3.14
XRFSH
  Top 0.152: IC2.66 56.67,20.68 61.16,16.2 IC3.11
XWR
  Top 0.152: IC2.64 55.67,20.38 59.85,16.2 IC3.13
ZX_A0  (via drill 0.3)
  Top 0.152: IC10.14 39.98,19.48 v40,19.55 | IC2.33 39.17,25.77 37.6,24.2 v37.6,23.45
  Bottom 0.152: v37.6,23.45 37.6,20.1 38.15,19.55 v40,19.55
ZX_A1  (via drill 0.3)
  Top 0.152: IC2.34 39.17,25.27 38.2,24.3 v38.2,22.8 | v38.45,20.15 40.3,20.15 40.62,19.82 IC10.13
  Bottom 0.152: v38.2,22.8 38.2,20.4 v38.45,20.15
ZX_A2
  Top 0.152: IC2.38 42.67,21.27 41.27,19.88 IC10.12
ZX_A3
  Top 0.152: IC2.39 43.17,20.73 41.92,19.48 IC10.11
ZX_A4
  Top 0.152: IC2.71 59.17,21.43 63.73,16.88 IC11.15
ZX_A5
  Top 0.152: IC2.70 58.67,21.27 63.73,16.23 IC11.16
ZX_A6
  Top 0.152: IC2.69 58.17,21.12 63.73,15.57 IC11.17
ZX_A7
  Top 0.152: IC2.68 57.67,20.98 63.58,15.07 63.73,14.93 IC11.18
ZX_A8
  Top 0.152: IC2.72 59.67,21.52 63.67,17.52 IC11.14
ZX_A9
  Top 0.152: IC2.73 62.48,24.27 62.6,24.15 62.6,22.05 66.47,18.18 IC11.13
ZX_A10
  Top 0.152: IC2.74 62.63,24.77 63.05,24.35 63.05,22.25 66.47,18.82 IC11.12
ZX_A11
  Top 0.152: IC2.75 62.78,25.27 63.5,24.55 63.5,22.45 66.47,19.48 IC11.11
ZX_A12  (via drill 0.3)
  Top 0.152: 39.3,18.95 v39.3,18.9 39.33,18.88 IC10.15 | IC2.32 39.02,26.27 v37,24.25
  Bottom 0.152: v37,24.25 37,19.95 38,18.95 39.25,18.95 v39.3,18.9
ZX_A13  (via drill 0.3)
  Top 0.152: v36.25,22.85 36.25,24.4 38.62,26.77 IC2.31 | v36.25,20.15 37.6,20.15 38.67,19.07 IC10.16
  Bottom 0.152: v36.25,22.85 v36.25,20.15
ZX_A14  (via drill 0.3)
  Top 0.152: v35.65,23.55 35.65,24.35 38.57,27.27 IC2.30 | IC10.17 38.02,18.68 37.15,19.55 v35.7,19.55
  Bottom 0.152: v35.65,23.55 35.65,19.8
  Bottom 0.254: v35.7,19.55 35.65,19.8
ZX_A15  (via drill 0.3)
  Top 0.152: v34.95,22.8 34.95,24.2 39.02,28.27 IC2.28 | IC10.18 37.38,18.57 37.05,18.95 35.15,18.95 34.95,19.15 v34.95,20.1
  Bottom 0.152: v34.95,22.8 v34.95,20.1

## Text on the board
tPlace: (C) 2020 Alvie Systems | Rev. 2 | ZX Spectrum Interface Z
bPlace: +5V | +9V
tNames: USR | IO0 | RST
bRework: CUT | CUT
tRework: CUT